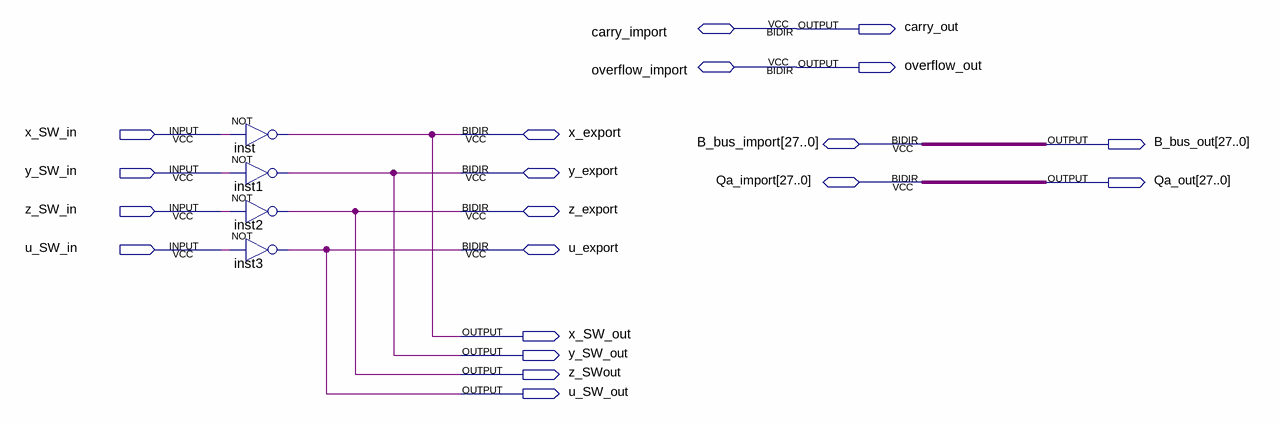
[diagram p0: schematic sheet]
// Quartus schematic second_output.bdf as structural Verilog: 4 symbols, 20 pins
module second_output (
  input  x_SW_in,
  input  y_SW_in,
  input  z_SW_in,
  input  u_SW_in,
  inout  carry_import,
  inout  overflow_import,
  inout  x_export,
  inout  [27:0] B_bus_import,
  inout  y_export,
  inout  [27:0] Qa_import,
  inout  z_export,
  inout  u_export,
  output carry_out,
  output overflow_out,
  output [27:0] B_bus_out,
  output [27:0] Qa_out,
  output x_SW_out,
  output y_SW_out,
  output z_SWout,
  output u_SW_out
);

  not inst (x_export, x_SW_in);
  not inst1 (y_export, y_SW_in);
  not inst2 (z_export, z_SW_in);
  not inst3 (u_export, u_SW_in);

  assign B_bus_out = B_bus_import;
  assign carry_out = carry_import;
  assign overflow_out = overflow_import;
  assign Qa_out = Qa_import;
  assign u_SW_out = u_export;
  assign x_SW_out = x_export;
  assign y_SW_out = y_export;
  assign z_SWout = z_export;
endmodule
